# Altium schematic sheet [1] Supply.SchDoc
size A4; DocumentNumber: 2; SheetNumber: 2; SheetTotal: 6
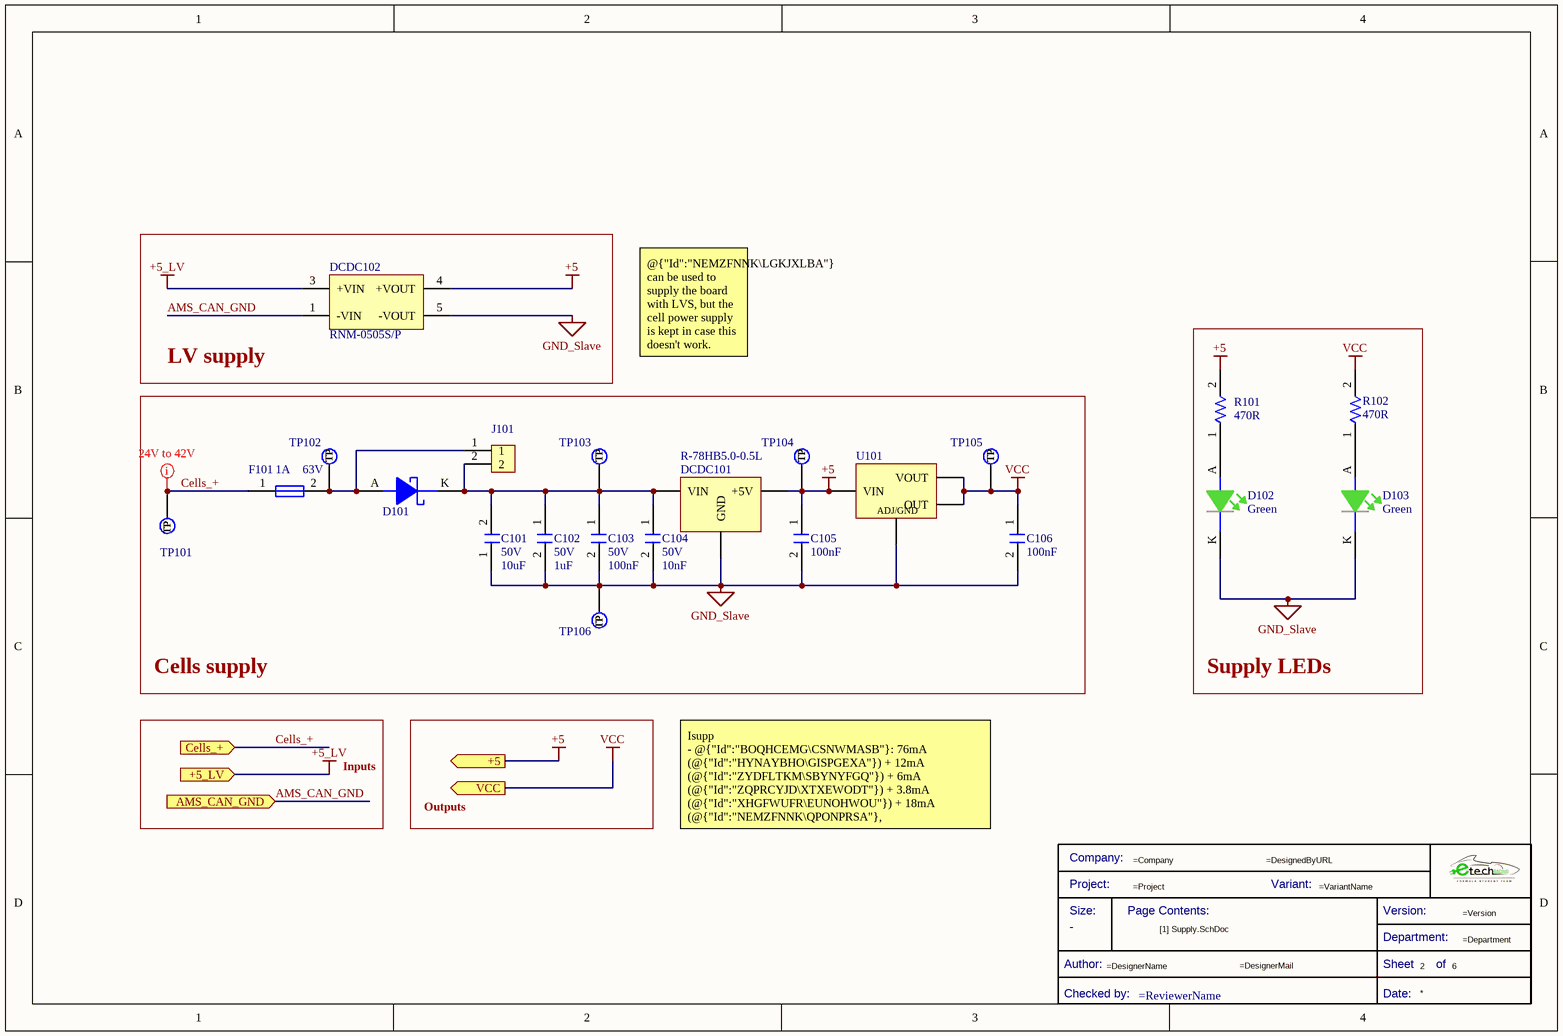
[diagram p0: [1] Supply.SchDoc]

## Parts
*  Title Block_template  (value not drawn)  (graphical)
C101  Voltage Rating: 50V  Capacitance: 10uF  [C10u-50V-1210FNPMLCC-X7R]  (hidden comment: GRJ32ER71H106KE11L)
C102  Voltage Rating: 50V  Capacitance: 1uF  [C0805FNPC-R]  (hidden comment: 885012207103)
C103  Voltage Rating: 50V  Capacitance: 100nF  [C0805FNPC-R]  (hidden comment: 885012207098)
C104  Voltage Rating: 50V  Capacitance: 10nF  [C0805FNPC-R]  (hidden comment: 885012207092)
C105  Capacitance: 100nF  [C0805FNPC-R]  (hidden comment: 885012207098)
C106  Capacitance: 100nF  [C0805FNPC-R]  (hidden comment: 885012207098)
D101  MBR0530  [DSC-SOD123]  (value not drawn)
D102  Color: Green  [LED_0805_WE]  (hidden comment: 150080VS75000)
D103  Color: Green  [LED_0805_WE]  (hidden comment: 150080VS75000)
DCDC101  R-78HB5.0-0.5L  [DCDC_Slaves]
DCDC102  RNM-0505S/P  [DCDC_RNM-0505S/P]
F101  Current Rating: 1A  Voltage Rating (DC): 63V  [Fuse_1206]  (hidden comment: 0437001.WRA)
J101  61300211121  [J_Pinheader_1x2]  (value not drawn)
R101  Resistance: 470R  [R0805FTK]  (hidden comment: CR0805-FX-4700GLF)
R102  Resistance: 470R  [R0805FTK]  (hidden comment: CR0805-FX-4700GLF)
TP101  TestPoint  [TestPoint]  (value not drawn)  (no BOM)
TP102  TestPoint  [TestPoint]  (value not drawn)  (no BOM)
TP103  TestPoint  [TestPoint]  (value not drawn)  (no BOM)
TP104  TestPoint  [TestPoint]  (value not drawn)  (no BOM)
TP105  TestPoint  [TestPoint]  (value not drawn)  (no BOM)
TP106  TestPoint  [TestPoint]  (value not drawn)  (no BOM)
U101  LM1117IMP-3.3/NOPB  [LDO_10V-0.8/3V3-SOT223]  (value not drawn)

## Blocks framed on the sheet
LV supply: DCDC102
Supply LEDs: D102 D103 R101 R102
Cells supply: C101-C106 D101 DCDC101 F101 J101 TP101-TP106 U101

## Ports
+5 (out), +5_LV (in), AMS_CAN_GND (in), Cells_+ (in), VCC (out)

## Nets
+5: C105.1 DCDC101.3(+5V) DCDC102.4(+VOUT) R101.2 TP104.1(TP) U101.3(VIN) ; port +5
+5_LV: DCDC102.3(+VIN) ; port +5_LV
GND_Slave: C101.1 C102.2 C103.2 C104.2 C105.2 C106.2 D102.K D103.K DCDC101.2(GND) DCDC102.5(-VOUT) TP106.1(TP) U101.1(ADJ/GND)
VCC: C106.1 R102.2 TP105.1(TP) U101.2(OUT) U101.4(VOUT) ; port VCC
AMS_CAN_GND: DCDC102.1(-VIN) ; port AMS_CAN_GND
Cells_+: F101.1 TP101.1(TP) ; port Cells_+
NetC101_2: C101.2 C102.1 C103.1 C104.1 D101.K DCDC101.1(VIN) J101.2 TP103.1(TP)
NetD101_A: D101.A F101.2 J101.1 TP102.1(TP)
NetD102_A: D102.A R101.1
NetD103_A: D103.A R102.1

## Layout directives
mark named 24V to 42V: Cells_+

## Notes on the sheet
- @{"Id":"NEMZFNNK\LGKJXLBA"} can be used to supply the board with LVS, but the cell power supply is kept in case this doesn't work.
- Inputs
- Outputs
- Isupp
  - @{"Id":"BOQHCEMG\CSNWMASB"}: 76mA (@{"Id":"HYNAYBHO\GISPGEXA"}) + 12mA (@{"Id":"ZYDFLTKM\SBYNYFGQ"}) + 6mA (@{"Id":"ZQPRCYJD\XTXEWODT"}) + 3.8mA (@{"Id":"XHGFWUFR\EUNOHWOU"}) + 18mA (@{"Id":"NEMZFNNK\QPONPRSA"}, @{"Id":"NEMZFNNK\AGQLGYTE"}) = 115.8mA
  Pdiss
  - @{"Id":"NEMZFNNK\PPWQNRXH"}: (5V-3.3V)*86mA = 19.5mW
- (in symbol Title Block_template) Company:; Project:; Variant:; Size:; Page Contents:; Version:; Department:; Author:; Sheet; of; Checked by:; Date:

## Library data of the parts
* = Title Block_template: Standard Title Block; Category: Title Block; Checked by:: =ReviewerName; Size: -
C101 = C10u-50V-1210FNPMLCC-X7R: Multilayer Ceramic Capacitors MLCC - SMD/SMT 1210 10uF 50volts X7R +/-10% Soft Term; Manufacturer: Murata; Tolerance: 10%; .Creator: DR; Supplier 1: Avnet; Manufacturer Part Number: GRJ32ER71H106KE11L; RoHS: Yes; Category: Ceramic Capacitors; Stock 1: 19000; Pricing 1: 1000=0,33327, 2000=0,32389, 4000=0,31450, 6000=0,30511, 8000=0,29572 (USD); Mount: Surface Mount; Case/Package: 1210; Case Code (Metric): 3225; Case Code (Imperial): 1210; Min Operating Temperature: -55°C; Max Operating Temperature: 125°C; Packaging: Tape and Reel; Features: Soft Termination; Length: 0.126inch; Width: 0.098inch; Thickness: 0.11inch; RoHS Compliant: Yes; ComponentLink1URL: https://eu.mouser.com/datasheet/2/281/GRJ32ER71H106KE11_01-1977929.pdf; ComponentLink1Description: Datasheet; Supplier Part Number 1: GRJ32ER71H106KE11L
C102 = C1u-50V-0805FNPC-X7R: Multilayer Ceramic Capacitor, Wcap-Csgp Series, 1 F, 10%, X7R, 50 V, 0805 [2012 Metric] Rohs Compliant: Yes; Manufacturer 1: Wurth Electronics; .Creator: GP; Supplier 1: RSComponents; Manufacturer Part Number 1: 885012207103; RoHS: Yes; Category: Ceramic Capacitors; Stock 1: 5100; Pricing 1: 50=0,27200, 250=0,25300, 500=0,22800, 1250=0,20100, 2500=0,17100 (GBP); Mount: Surface Mount; Case/Package: 0805; Case Code (Metric): 2012; Case Code (Imperial): 0805; Min Operating Temperature: -55°C; Max Operating Temperature: 85°C; Packaging: Cut Tape; Dielectric: X7R; Tolerance: 10%; Voltage Rating (DC): 50V; Length: 0.079inch; Width: 0.049inch; Thickness: 0.053inch; REACH SVHC: Unknown; RoHS Compliant: Yes; ComponentLink1URL: http://www.farnell.com/datasheets/1958501.pdf?src-supplier=Farnell; ComponentLink1Description: http://www.farnell.com/datasheets/1958501.pdf?src-supplier=Farnell; ComponentLink2URL: http://www.farnell.com/datasheets/1958501.pdf?src-supplier=Element14; ComponentLink2Description: http://www.farnell.com/datasheets/1958501.pdf?src-supplier=Element14; ComponentLink3URL: https://katalog.we-online.de/pbs/datasheet/885012107003.pdf?src-supplier=Digi-Key; ComponentLink3Description: https://katalog.we-online.de/pbs/datasheet/885012107003.pdf?src-supplier=Digi-Key; ComponentLink4URL: http://www.farnell.com/datasheets/1958501.pdf?src-supplier=Newark; ComponentLink4Description: http://www.farnell.com/datasheets/1958501.pdf?src-supplier=Newark; Supplier Part Number 1: 1813523
C103 C105 C106 = C100n-50V-0805FNPC-X7R: Cap, 0.1ΜF, 50V, 10%, X7R, 0805; Manufacturer 1: Wurth Electronics; .Creator: DR; Supplier 1: RSComponents; Manufacturer Part Number 1: 885012207098; RoHS: Yes; Category: Ceramic Capacitors; Stock 1: 8000; Pricing 1: 100=0,10200, 500=0,07100, 2000=0,06100 (GBP); Mount: Surface Mount; Case/Package: 0805; Case Code (Metric): 2012; Case Code (Imperial): 0805; Min Operating Temperature: -55°C; Max Operating Temperature: 125°C; Packaging: Cut Tape; Dielectric: X7R; Tolerance: 10%; Voltage Rating (DC): 50V; Length: 0.079inch; Width: 0.049inch; Thickness: 0.035inch; REACH SVHC: Unknown; RoHS Compliant: Yes; ComponentLink1URL: http://www.farnell.com/datasheets/1958498.pdf?src-supplier=Farnell; ComponentLink1Description: http://www.farnell.com/datasheets/1958498.pdf?src-supplier=Farnell; ComponentLink2URL: http://www.farnell.com/datasheets/1958498.pdf?src-supplier=Element14; ComponentLink2Description: http://www.farnell.com/datasheets/1958498.pdf?src-supplier=Element14; ComponentLink3URL: https://katalog.we-online.de/pbs/datasheet/885012207098.pdf?src-supplier=Digi-Key; ComponentLink3Description: https://katalog.we-online.de/pbs/datasheet/885012207098.pdf?src-supplier=Digi-Key; ComponentLink4URL: http://www.farnell.com/datasheets/1958498.pdf?src-supplier=Newark; ComponentLink4Description: http://www.farnell.com/datasheets/1958498.pdf?src-supplier=Newark; Supplier Part Number 1: 1813493
  C105 C106: Voltage Rating: 50V
C104 = C10n-50V-0805FNPC-X7R: Cap, 0.01ΜF, 50V, 10%, X7R, 0805; Manufacturer 1: Wurth Electronics; .Creator: DR; Supplier 1: RSComponents; Manufacturer Part Number 1: 885012207092; RoHS: Yes; Category: Ceramic Capacitors; Stock 1: 1; Pricing 1: 4000=0,03200, 12000=0,03100 (USD); Mount: Surface Mount; Case/Package: 0805; Case Code (Metric): 2012; Case Code (Imperial): 0805; Min Operating Temperature: -55°C; Max Operating Temperature: 125°C; Packaging: Cut Tape; Dielectric: X7R; Tolerance: 10%; Voltage Rating (DC): 50V; Length: 0.079inch; Width: 0.049inch; Thickness: 0.035inch; REACH SVHC: Unknown; RoHS Compliant: Yes; ComponentLink1URL: http://www.farnell.com/datasheets/1958497.pdf?src-supplier=Farnell; ComponentLink1Description: http://www.farnell.com/datasheets/1958497.pdf?src-supplier=Farnell; ComponentLink2URL: http://www.farnell.com/datasheets/1958497.pdf?src-supplier=Element14; ComponentLink2Description: http://www.farnell.com/datasheets/1958497.pdf?src-supplier=Element14; ComponentLink3URL: http://www.farnell.com/datasheets/1958497.pdf?src-supplier=Newark; ComponentLink3Description: http://www.farnell.com/datasheets/1958497.pdf?src-supplier=Newark; ComponentLink4URL: https://katalog.we-online.de/pbs/datasheet/885012207092.pdf?src-supplier=Digi-Key; ComponentLink4Description: https://katalog.we-online.de/pbs/datasheet/885012207092.pdf?src-supplier=Digi-Key; Supplier Part Number 1: 1813941
D101 = DSC-0.5/30-SOD123: VR=30V IF=500mA 30pF P=410mW; Element Configuration: Single; Forward Voltage: 430mV; Peak Non-Repetitive Surge Current: 5.5A; Average Rectified Current: 500mA; Max Reverse Leakage Current: 130uA; Max Reverse Voltage (DC): 30V; Polarity: Standard; .Creator: GP; Category: Diode; ComponentLink1Description: Datasheet; ComponentLink1URL: *; ComponentLink2Description: Where buy it; ComponentLink2URL: *; Supplier 1: Newark; Stock 1: 9; Pricing 1: 1=0,34400, 10=0,23900, 100=0,12200, 500=0,10000 (USD); Mount: Surface Mount; Contact Plating: Tin,Matte; Weight: 0.03g; Package Quantity: 1; Max Surge Current: 5.5A; Forward Current: 500mA; Max Reverse Current: 130uA; Max Repetitive Reverse Voltage (Vrrm): 30V; Max Forward Surge Current (Ifsm): 5.5A; Voltage Rating (DC): 30V; Current Rating: 500mA; Output Current: 500mA; Series: -; Length: 2.7mm; Width: 1.6mm; Height: 1.03mm; Radiation Hardening: No; RoHS Compliant: Yes; REACH SVHC: No SVHC; Lead Free: Lead Free; ComponentLink3URL: https://datasheet.ciiva.com/30479/0900766b810e2512-30479401.pdf?src-supplier=RSComponents; ComponentLink3Description: https://datasheet.ciiva.com/30479/0900766b810e2512-30479401.pdf?src-supplier=RSComponents; ComponentLink4URL: https://datasheet.ciiva.com/34301/974753-34301826.pdf?src-supplier=Jameco; ComponentLink4Description: https://datasheet.ciiva.com/34301/974753-34301826.pdf?src-supplier=Jameco; ComponentLink5URL: https://datasheet.ciiva.com/910/mbr0530-910516.pdf?src-supplier=Digi-Key; ComponentLink5Description: https://datasheet.ciiva.com/910/mbr0530-910516.pdf?src-supplier=Digi-Key; ComponentLink6URL: https://datasheet.ciiva.com/25931/mbr0530-25931989.pdf?src-supplier=Avnet+Europe; ComponentLink6Description: https://datasheet.ciiva.com/25931/mbr0530-25931989.pdf?src-supplier=Avnet+Europe; ComponentLink7URL: https://datasheet.ciiva.com/8300/mbr0530-8300905.pdf?src-supplier=Avnet; ComponentLink7Description: https://datasheet.ciiva.com/8300/mbr0530-8300905.pdf?src-supplier=Avnet; ComponentLink8URL: https://datasheet.ciiva.com/17318/mbr0530-17318568.pdf?src-supplier=Future+Electronics; ComponentLink8Description: https://datasheet.ciiva.com/17318/mbr0530-17318568.pdf?src-supplier=Future+Electronics; ComponentLink9URL: https://datasheet.ciiva.com/15144/getdatasheetpartid-86760-15144598.pdf?src-supplier=Verical; ComponentLink9Description: https://datasheet.ciiva.com/15144/getdatasheetpartid-86760-15144598.pdf?src-supplier=Verical; ComponentLink10URL: https://datasheet.ciiva.com/910/mbr0530-910518.pdf?src-supplier=Digi-Key; ComponentLink10Description: https://datasheet.ciiva.com/910/mbr0530-910518.pdf?src-supplier=Digi-Key; Supplier Part Number 1: 15R3453
D102 D103 = LEDVS-0805-40: Led, Green, 570 Nm, 2 V, 30 Ma, 40 Mcd Rohs Compliant: Yes; Manufacturer 1: Wurth Electronics; Luminous Intensity: 40mcd; Forward Current: 30mA; Forward Voltage: 2V; Viewing Angle: 140°; Wavelength: 570nm; Lens Style: Clear,Rectangular; Test Current: 20mA; .Creator: DR; ComponentLink1Description: Datasheet; ComponentLink1URL: https://www.we-online.com/catalog/datasheet/150080VS75000.pdf; ComponentLink2Description: Where buy it; ComponentLink2URL: https://katalog.we-online.de/en/led/WL-SMCW/150080VS75000; Supplier 1: RSComponents; Manufacturer Part Number 1: 150080VS75000; RoHS: Yes; Category: LEDs; Stock 1: 850; Pricing 1: 50=0,19300, 500=0,12900, 1000=0,12300, 2000=0,11700, 4000=0,11100 (USD); Mount: Surface Mount; Case/Package: 0805; Case Code (Metric): 2012; Case Code (Imperial): 0805; Min Operating Temperature: -40°C; Max Operating Temperature: 85°C; Package Quantity: 4000; Packaging: Tape and Reel; Dominant Wavelength: 570nm; Length: 2mm; Width: 1.25mm; Height: 0.7mm; REACH SVHC: Unknown; ComponentLink3URL: https://datasheet.ciiva.com/22656/150080vs75000-22656966.pdf?src-supplier=Element14; ComponentLink3Description: https://datasheet.ciiva.com/22656/150080vs75000-22656966.pdf?src-supplier=Element14; ComponentLink4URL: https://datasheet.ciiva.com/29279/759437-da-01-en-chipled-0805-w-kl-h-gruen-150080vs7500-29279047.pdf?src-supplier=Conrad; ComponentLink4Description: https://datasheet.ciiva.com/29279/759437-da-01-en-chipled-0805-w-kl-h-gruen-150080vs7500-29279047.pdf?src-supplier=Conrad; ComponentLink5URL: https://datasheet.ciiva.com/29563/150080vs75000-29563018.pdf?src-supplier=Digi-Key; ComponentLink5Description: https://datasheet.ciiva.com/29563/150080vs75000-29563018.pdf?src-supplier=Digi-Key; Supplier Part Number 1: 8154237
DCDC101 = DCDC-72V/5V-0.5A: 0.5A DC/DC-Converter 'INNOLINE' SIP3 reg; V. In: 9-72; V. Out: 5.0; mA. Out: 500; Manufacturer 1: Recom; Min Input Voltage: 9V; Max Input Voltage: 72V; Number of Outputs: 1; Nominal Output Voltage: 5V; Max Output Current: 500mA; Efficiency: 87%; Nominal Input Voltage: 48V; Isolation Voltage: 1.6kV; Power Rating: 2.5W; Isolation: Non-Isolated; Accuracy: 2%; Pitch: 2.54mm; .Creator: DR; ComponentLink1URL: https://www.mouser.es/datasheet/2/468/R-78HB-0.5-1711026.pdf; ComponentLink1Description: Datasheet; ComponentLink2Description: Where buy it; ComponentLink2URL: https://www.mouser.es/ProductDetail/RECOM-Power/R-78HB50-05L?qs=XF8hdbuHJAWcQ9kfabZ7zw%3D%3D; Supplier 1: RSComponents; Manufacturer Part Number 1: R-78HB5.0-0.5L; RoHS: Yes; Category: Voltage Regulators - Switching; Stock 1: 1; Pricing 1: 1=15,32000, 5=14,71600, 10=14,39500, 25=14,10000, 50=13,80500 (USD); Mount: Through Hole,PCB; Case/Package: SIP; Weight: 4g; Min Operating Temperature: -40°C; Max Operating Temperature: 85°C; Output Voltage: 5V; Packaging: Rail/Tube; Output Current: 500mA; Min Input Voltage (DC): 9V; Max Input Voltage (DC): 72V; Package Quantity: 42; Voltage - Output 1: 5V; Current - Output 1: 500mA; Output Power: 2.5W; Max Output Power: 2.5W; Max Power Dissipation: 2.5W; Max Output Voltage: 5V; Features: OTP,SCP; Series: INNOLINE R-78HBxx; Length: 11.5mm; Width: 8.5mm; Height: 17.5mm; Depth: 11.5mm; REACH SVHC: No SVHC; Lead Free: Lead Free; RoHS Compliant: Yes; ComponentLink3URL: https://datasheet.ciiva.com/11837/0900766b80d61d69-11837279.pdf?src-supplier=RSComponents; ComponentLink3Description: https://datasheet.ciiva.com/11837/0900766b80d61d69-11837279.pdf?src-supplier=RSComponents; ComponentLink4URL: https://datasheet.ciiva.com/29184/676157-da-01-en-dc-dc-wandler-r-78hb5-0-0-5l-29184439.pdf?src-supplier=Conrad; ComponentLink4Description: https://datasheet.ciiva.com/29184/676157-da-01-en-dc-dc-wandler-r-78hb5-0-0-5l-29184439.pdf?src-supplier=Conrad; ComponentLink5URL: https://datasheet.ciiva.com/2374/r-78hbxx-0-5-l-2374159.pdf?src-supplier=Digi-Key; ComponentLink5Description: https://datasheet.ciiva.com/2374/r-78hbxx-0-5-l-2374159.pdf?src-supplier=Digi-Key; ComponentLink6URL: https://datasheet.ciiva.com/4645/r-78hbxx-0-5-l-226048-4645094.pdf?src-supplier=Mouser; ComponentLink6Description: https://datasheet.ciiva.com/4645/r-78hbxx-0-5-l-226048-4645094.pdf?src-supplier=Mouser; ComponentLink7URL: https://datasheet.ciiva.com/14184/r78hbxx05-eng-datasheet-14184326.pdf?src-supplier=Distrelec; ComponentLink7Description: https://datasheet.ciiva.com/14184/r78hbxx05-eng-datasheet-14184326.pdf?src-supplier=Distrelec; Supplier Part Number 1: 6727095P
DCDC102 = DCDC_RNM-0505S/P: 1W DC/DC-Converter 'ECONOLINE' DIP6 1kV unreg; V. In: 05; V. Out: 05; mA. Out: 200; Manufacturer: Recom; Min Input Voltage: 4.5V; Number of Outputs: 1; Voltage - Output 1: 5V; Max Input Voltage: 5.5V; Max Output Current: 200mA; Efficiency: 78%; Isolation: Isolated; .Creator: GP; ComponentLink1Description: Where buy it; ComponentLink1URL: https://recom-power.com/en/products/dc-dc-converters/rec-p-RNM-0505S!sP.html?0; Supplier 1: Digi-Key; RoHS: Yes; Category: Voltage Regulators - Switching; Pricing 1: 1=8,32000, 5=8,20400, 10=8,08600, 25=7,84840, 50=7,61040, 100=7,37260, 250=7,13476, 440=6,65909 (USD); Mount: Through Hole; Case/Package: DIP; Number of Pins: 4; Weight: 1.1g; Min Operating Temperature: -40°C; Max Operating Temperature: 85°C; Output Power: 1W; Packaging: Rail/Tube; Isolation Voltage: 1kV; Package Quantity: 60; Nominal Input Voltage: 5V; Max Power Dissipation: 1W; Max Output Voltage: 5V; Features: SCP; Series: ECONOLINE RNM; Output Current: 200mA; Output Voltage: 5V; Max Output Power: 1W; Current - Output 1: 200mA; Min Input Voltage (DC): 4.5V; Max Input Voltage (DC): 5.5V; Length: 8.3mm; Width: 8.3mm; Height: 6.8mm; Depth: 8.3mm; Lead Free: Lead Free; RoHS Compliant: Yes; ComponentLink2URL: https://datasheet.ciiva.com/2172/rnm-2172491.pdf?src-supplier=Digi-Key; ComponentLink2Description: https://datasheet.ciiva.com/2172/rnm-2172491.pdf?src-supplier=Digi-Key; Supplier Part Number 1: 945-2307-5-ND; Manufacturer Part Number: RNM-0505S/P
F101 = Fuse_1A_63V_1206: Fuse Chip Fast Acting 1A 63V SMD Solder Pad 1206 Ceramic T/R Automotive; Manufacturer: Littelfuse; Fuse Type: Board Mount (Cartridge Style Excluded); Approvals: CSA,cURus; .Creator: DO; Supplier 1: Digi-Key; Manufacturer Part Number: 0437001.WRA; RoHS: Yes; Category: Fuses; Stock 1: 5820; Pricing 1: 1=1,52000, 5=1,47000, 10=1,37600, 50=1,13860, 100=0,94880, 250=0,92508, 500=0,78276, 1000=0,68788 (USD); Mount: Surface Mount; Case/Package: 1206; Case Code (Imperial): 1206; Case Code (Metric): 3216; Min Operating Temperature: -55°C; Max Operating Temperature: 150°C; Packaging: Tape and Reel; Voltage Rating (AC): 63V; ComponentLink1URL: https://www.littelfuse.com/~/media/electronics/datasheets/fuses/littelfuse_fuse_437a_datasheet.pdf.pdf?src-supplier=Digi-Key; ComponentLink1Description: https://www.littelfuse.com/~/media/electronics/datasheets/fuses/littelfuse_fuse_437a_datasheet.pdf.pdf?src-supplier=Digi-Key; Supplier Part Number 1: F10001CT-ND; ComponentLink2Description: Where buy it; ComponentLink2URL: https://www.mouser.es/ProductDetail/Littelfuse/0437001WRA?qs=DXv0QSHKF4z9CJhPXjxR%252BA%3D%3D
J101 = J_Jumper: CONN HEADER 2 POS 2.54; Manufacturer: Molex; Temperature rating: -40° to +105°C; Category type: PCB-PCB; Product name: Pin Header; Maximum current: 3 A; Maximum voltage: 250 V AC; Connections: 1x2; Current Rating: 3A; Voltage Rating: 250V; Number of Positions: 2; Gender: Male; Connector Type: Male Pin; Pitch: 0.1inch; .Creator: GP; Category: Connector; ComponentLink1Description: Datasheet; ComponentLink1URL: https://www.we-online.com/catalog/datasheet/61300211121.pdf; ComponentLink2Description: Where buy it; ComponentLink2URL: https://www.we-online.com/catalog/en/PHD_2_54_THT_PIN_HEADER_6130XX11121?sq=61300211121&sp=https%3A%2F%2Fwww.we-online.com%2Fweb%2Fen%2Fwuerth_elektronik%2Fsearchpage.php%3Fsearch%3D61300211121#61300211121; Manufacturer part number: 61300211121; Supplier: Würth Elektronik; RoHS: *; Application: Shortcircuit; Flammability: 94V-0; Orientation: Vertical; Mount: Through hole; Supplier 1: RSComponents; Stock 1: 1855; Pricing 1: 5=0,14100, 50=0,09700, 100=0,07800, 200=0,07300, 500=0,06800 (USD); Contact Plating: Gold; Housing Material: PBT; Contact Material: Copper Alloy,Copper; Color: Black; Min Operating Temperature: -40°C; Max Operating Temperature: 125°C; Number of Rows: 1; Contact Gender: Male; Packaging: Bulk; Termination: Through Hole; Number of Contacts: 2; Contact Mating Length: 0.236inch; REACH SVHC: Unknown; Lead Free: Lead Free; ComponentLink3URL: https://datasheet.ciiva.com/13619/6130xx11121-48870-13619345.pdf?src-supplier=Mouser; ComponentLink3Description: https://datasheet.ciiva.com/13619/6130xx11121-48870-13619345.pdf?src-supplier=Mouser; Supplier Part Number 1: 8281581
R101 R102 = R470-0805FTK: Res Thick Film 0805 470 Ohm 1% 1/8W ±100ppm/°C Molded SMD SMD Paper Tape on Plastic Reel; Manufacturer 1: Bourns; Power Rating: 125mW; Voltage Rating: 150V; .Creator: DR; Supplier 1: Arrow Electronics; Manufacturer Part Number 1: CR0805-FX-4700GLF; RoHS: Yes; Category: Chip SMD Resistors; Stock 1: 12623; Pricing 1: 1=0,00990, 10=0,00980, 25=0,00950, 50=0,00940, 100=0,00930, 250=0,00920, 500=0,00910, 1000=0,00890, 3000=0,00870, 6000=0,00860 (USD); Mount: Surface Mount; Case/Package: 0805; Number of Pins: 2; Case Code (Imperial): 0805; Case Code (Metric): 2012; Contact Plating: Tin; Min Operating Temperature: -55°C; Max Operating Temperature: 155°C; Packaging: Tape and Reel; Tolerance: 1%; Resistor Type: Thick Film; Termination: SMD/SMT; Temperature Coefficient: 100ppm/°C; Voltage Rating (DC): 150V; Features: Moisture Resistant; Series: CR0805; Max Power Dissipation: 125mW; Number of Terminations: 2; Resistance Tolerance: 1%; Construction: Rectangular; Technology: THICK FILM; Length: 2mm; Height: 0.5mm; Depth: 1.25mm; Thickness: 508um; Radiation Hardening: No; REACH SVHC: No SVHC; Military Standard: Not; ComponentLink1URL: https://datasheet.ciiva.com/11808/0900766b80fcdb72-11808686.pdf?src-supplier=RSComponents; ComponentLink1Description: https://datasheet.ciiva.com/11808/0900766b80fcdb72-11808686.pdf?src-supplier=RSComponents; ComponentLink2URL: https://datasheet.ciiva.com/7985/1856384-7985880.pdf?src-supplier=Element14; ComponentLink2Description: https://datasheet.ciiva.com/7985/1856384-7985880.pdf?src-supplier=Element14; ComponentLink3URL: https://datasheet.ciiva.com/22693/1902866-22693247.pdf?src-supplier=Element14; ComponentLink3Description: https://datasheet.ciiva.com/22693/1902866-22693247.pdf?src-supplier=Element14; ComponentLink4URL: https://datasheet.ciiva.com/5541/chpreztr-5541930.pdf?src-supplier=Mouser; ComponentLink4Description: https://datasheet.ciiva.com/5541/chpreztr-5541930.pdf?src-supplier=Mouser; Supplier Part Number 1: CR0805-FX-4700GLF
TP101-TP106 = TestPoint: Test Point 1x1 mm; .Creator: GP; Category: TestPoint; .PCBcheck: GP; .SCHcheck: GP
U101 = LDO_10V-0.8/3V3-SOT223: LDO Regulator Pos 3.3V 0.8A 4-Pin(3+Tab) SOT-223 T/R / IC REG LDO 3.3V 0.8A SOT223; Manufacturer: Texas Instruments; Number of Outputs: 1; Max Input Voltage: 15V; Max Output Current: 800mA; Polarity: Positive; Quiescent Current: 15mA; Accuracy: 1%; Output Type: Fixed; Dropout Voltage: 1.2V; Min Input Voltage: 2.6V; Max Supply Voltage: 10V; Min Supply Voltage: 4.75V; Current Rating: 800A; .Creator: GP; ComponentLink1URL: https://www.ti.com/lit/ds/symlink/lm1117.pdf?HQS=dis-mous-null-mousermode-dsf-pf-null-wwe&DCM=yes&ref_url=https%3A%2F%2Fwww.mouser.de%2F&distId=26; ComponentLink1Description: Datasheet; ComponentLink2Description: Where buy it; ComponentLink2URL: https://www.mouser.es/ProductDetail/Texas-Instruments/LM1117IMP-33-NOPB?qs=X1J7HmVL2ZFbpN1TgOsjYQ%3D%3D; Supplier 1: Digi-Key; Manufacturer Part Number: LM1117IMP-3.3/NOPB; RoHS: Yes; Category: LDO; Pricing 1: 1=1,41000, 10=1,26300, 25=1,19920, 100=0,98500, 250=0,92072, 500=0,81366 (USD); Mount: Surface Mount; Case/Package: SOT-223; Number of Pins: 4; Min Operating Temperature: -40°C; Max Operating Temperature: 125°C; Output Voltage: 3.3V; Packaging: Tape and Reel; Output Current: 800mA; Nominal Output Voltage: 3.3V; Termination: SMD/SMT; Output Voltage Accuracy: 1%; Number of Regulators: 1; Min Current Limit: 800mA; Package Quantity: 1000; Length: 6.5mm; Width: 3.56mm; Height: 1.6mm; Radiation Hardening: No; REACH SVHC: No SVHC; Lead Free: Lead Free; RoHS Compliant: Yes; ComponentLink3URL: https://datasheet.ciiva.com/27051/1281318-27051810.pdf?src-supplier=Jameco; ComponentLink3Description: https://datasheet.ciiva.com/27051/1281318-27051810.pdf?src-supplier=Jameco; ComponentLink4URL: https://datasheet.ciiva.com/8042/1670636-8042261.pdf?src-supplier=Element14; ComponentLink4Description: https://datasheet.ciiva.com/8042/1670636-8042261.pdf?src-supplier=Element14; ComponentLink5URL: https://datasheet.ciiva.com/1570/1849796-1570171.pdf?src-supplier=Farnell; ComponentLink5Description: https://datasheet.ciiva.com/1570/1849796-1570171.pdf?src-supplier=Farnell; ComponentLink6URL: https://datasheet.ciiva.com/14149/lm1117-eng-tds-14149980.pdf?src-supplier=Distrelec; ComponentLink6Description: https://datasheet.ciiva.com/14149/lm1117-eng-tds-14149980.pdf?src-supplier=Distrelec; ComponentLink7URL: https://datasheet.ciiva.com/46386/1882372-46386042.pdf?src-supplier=Element14; ComponentLink7Description: https://datasheet.ciiva.com/46386/1882372-46386042.pdf?src-supplier=Element14; ComponentLink8URL: https://datasheet.ciiva.com/3223/lm1117-n-3223515.pdf?src-supplier=Avnet; ComponentLink8Description: https://datasheet.ciiva.com/3223/lm1117-n-3223515.pdf?src-supplier=Avnet; ComponentLink9URL: https://datasheet.ciiva.com/6580/lm1117-n-6580030.pdf?src-supplier=Digi-Key; ComponentLink9Description: https://datasheet.ciiva.com/6580/lm1117-n-6580030.pdf?src-supplier=Digi-Key; ComponentLink10URL: https://datasheet.ciiva.com/6580/lm1117-n-6580026.pdf?src-supplier=Digi-Key; ComponentLink10Description: https://datasheet.ciiva.com/6580/lm1117-n-6580026.pdf?src-supplier=Digi-Key; Supplier Part Number 1: LM1117IMP-3.3/NOPBCT-ND